# EAGLE schematic udisk (EAGLE 4.16)

## Sheet 1 of 7
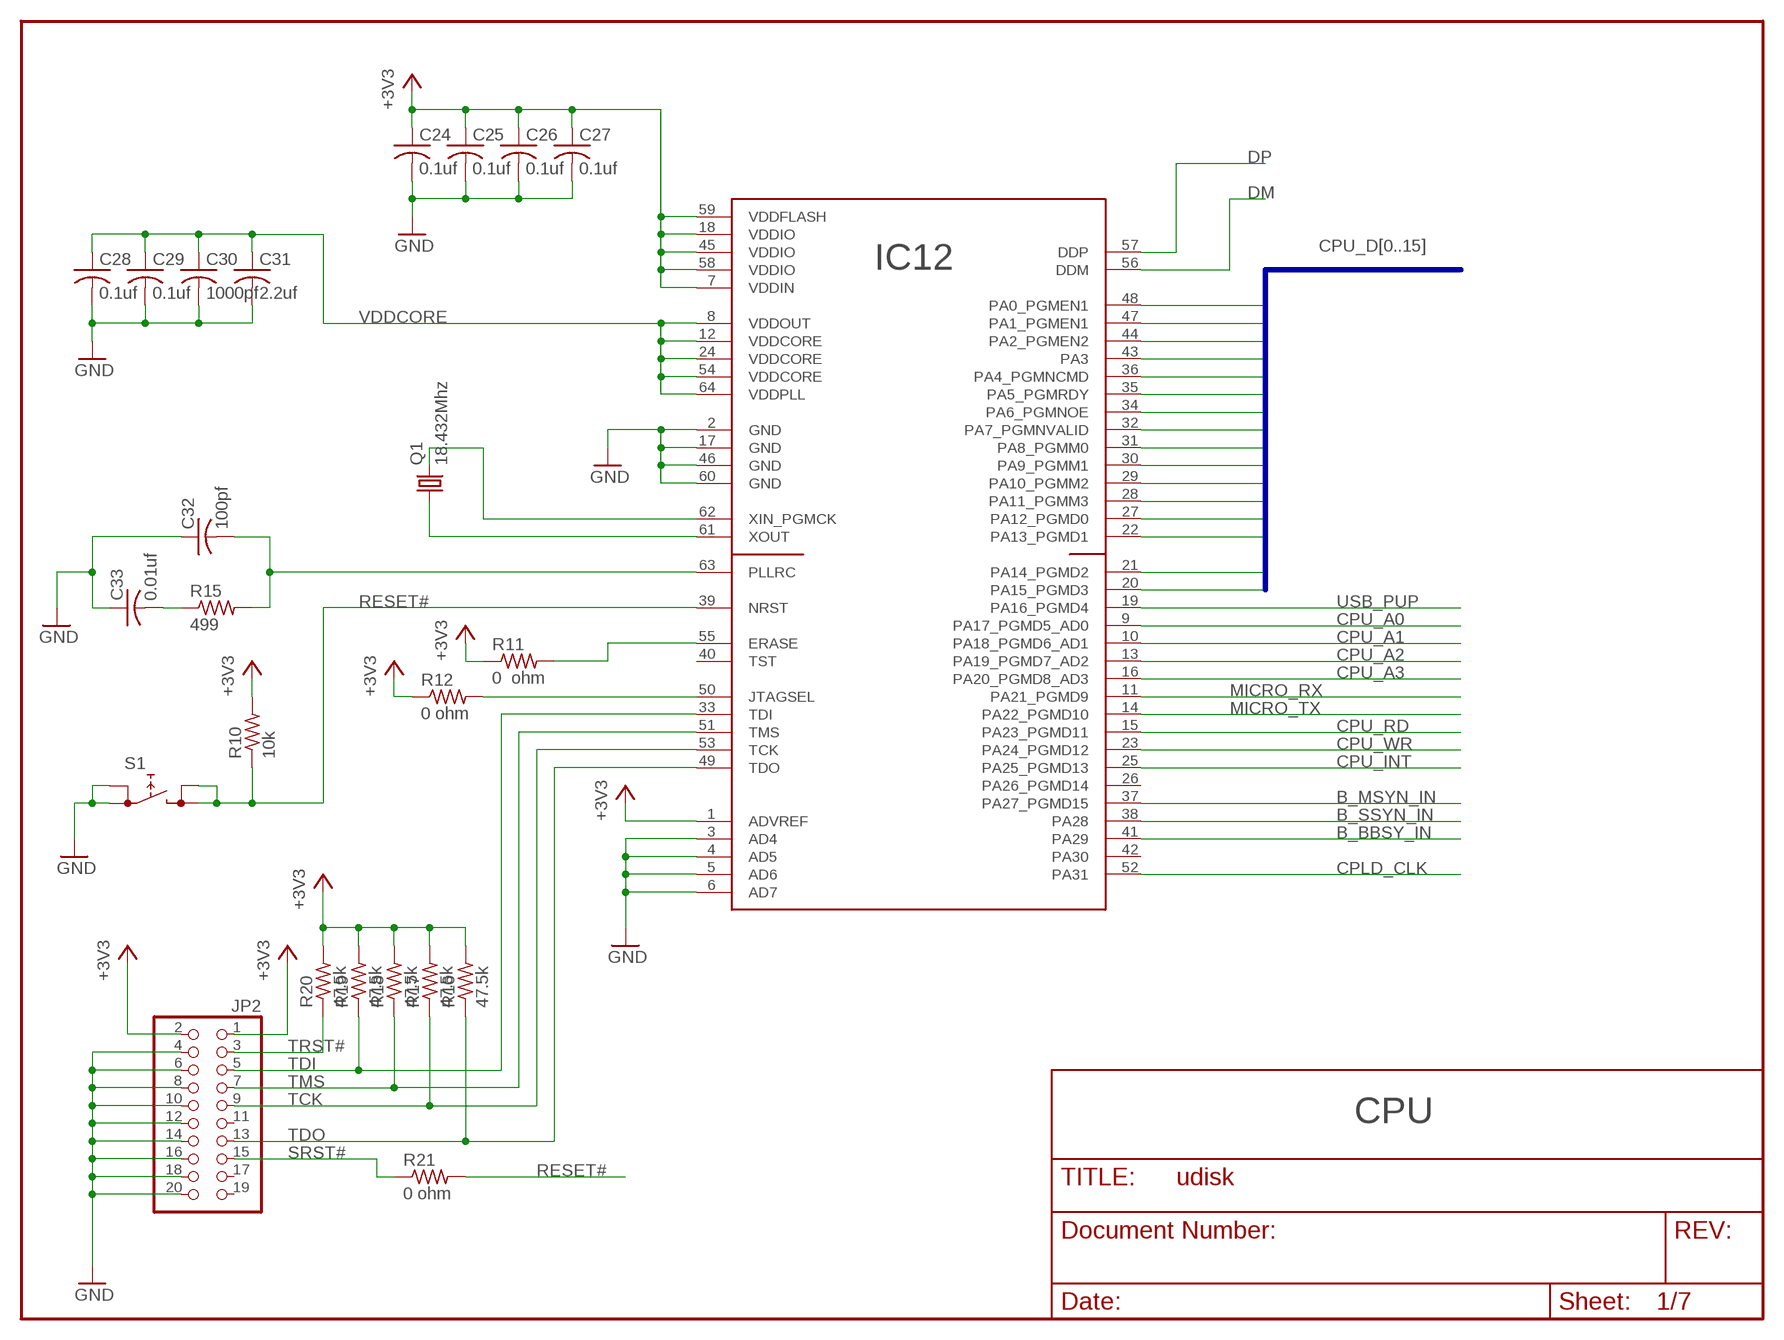
[diagram p0: schematic, sheet 1]

### Parts
C24  0.1uf  C-USC0603  [C0603]
C25  0.1uf  C-USC0603  [C0603]
C26  0.1uf  C-USC0603  [C0603]
C27  0.1uf  C-USC0603  [C0603]
C28  0.1uf  C-USC0603  [C0603]
C29  0.1uf  C-USC0603  [C0603]
C30  1000pf  C-USC0805  [C0805]
C31  2.2uf  C-USC1206  [C1206]
C32  100pf  C-USC0805  [C0805]
C33  0.01uf  C-USC0805  [C0805]
IC12  AT91SAM7S64_LQFP64  [LQFP64]
JP2  PINHD-2X10  [2X10]
Q1  18.432Mhz  CTS406  [SM406]
R10  10k  R-US_R0805  [R0805]
R11  0 ohm  R-US_R0805  [R0805]
R12  0 ohm  R-US_R0805  [R0805]
R15  499  R-US_M0805  [M0805]
R16  47.5k  R-US_R0805  [R0805]
R17  47.5k  R-US_R0805  [R0805]
R18  47.5k  R-US_R0805  [R0805]
R19  47.5k  R-US_R0805  [R0805]
R20  47.5k  R-US_R0805  [R0805]
R21  0 ohm  R-US_R0805  [R0805]
S1  KSC241J  [KSC241J]

### Nets
+3V3: C24.1 C25.1 C26.1 C27.1 IC12.1(ADVREF) IC12.7(VDDIN) IC12.18(VDDIO) IC12.45(VDDIO) IC12.58(VDDIO) IC12.59(VDDFLASH) JP2.1 JP2.2 R10.2 R11.1 R12.1 R16.2 R17.2 R18.2 R19.2 R20.2 ; also sheet 2,5,6,7
B_BBSY_IN: IC12.41(PA29) ; also sheet 2,3
B_MSYN_IN: IC12.37(PA27_PGMD15) ; also sheet 2,3
B_SSYN_IN: IC12.38(PA28) ; also sheet 2,3
CPLD_CLK: IC12.52(PA31) ; also sheet 2
CPU_A0: IC12.9(PA17_PGMD5_AD0) ; also sheet 2,6
CPU_A1: IC12.10(PA18_PGMD6_AD1) ; also sheet 2,6
CPU_A2: IC12.13(PA19_PGMD7_AD2) ; also sheet 2,6
CPU_A3: IC12.16(PA20_PGMD8_AD3) ; also sheet 2
CPU_D0: IC12.48(PA0_PGMEN1) ; also sheet 2,6
CPU_D1: IC12.47(PA1_PGMEN1) ; also sheet 2,6
CPU_D2: IC12.44(PA2_PGMEN2) ; also sheet 2,6
CPU_D3: IC12.43(PA3) ; also sheet 2,6
CPU_D4: IC12.36(PA4_PGMNCMD) ; also sheet 2,6
CPU_D5: IC12.35(PA5_PGMRDY) ; also sheet 2,6
CPU_D6: IC12.34(PA6_PGMNOE) ; also sheet 2,6
CPU_D7: IC12.32(PA7_PGMNVALID) ; also sheet 2,6
CPU_D8: IC12.31(PA8_PGMM0) ; also sheet 2,6
CPU_D9: IC12.30(PA9_PGMM1) ; also sheet 2,6
CPU_D10: IC12.29(PA10_PGMM2) ; also sheet 2,6
CPU_D11: IC12.28(PA11_PGMM3) ; also sheet 2,6
CPU_D12: IC12.27(PA12_PGMD0) ; also sheet 2,6
CPU_D13: IC12.22(PA13_PGMD1) ; also sheet 2,6
CPU_D14: IC12.21(PA14_PGMD2) ; also sheet 2,6
CPU_D15: IC12.20(PA15_PGMD3) ; also sheet 2,6
CPU_INT: IC12.25(PA25_PGMD13) ; also sheet 2
CPU_RD: IC12.15(PA23_PGMD11) ; also sheet 2
CPU_WR: IC12.23(PA24_PGMD12) ; also sheet 2
DM: IC12.56(DDM) ; also sheet 7
DP: IC12.57(DDP) ; also sheet 7
GND: C24.2 C25.2 C26.2 C27.2 C28.2 C29.2 C30.2 C31.2 C32.1 C33.1 IC12.2(GND) IC12.3(AD4) IC12.4(AD5) IC12.5(AD6) IC12.6(AD7) IC12.17(GND) IC12.46(GND) IC12.60(GND) JP2.4 JP2.6 JP2.8 JP2.10 JP2.12 JP2.14 JP2.16 JP2.18 JP2.20 S1.P1 S1.P2 ; also sheet 2,3,4,5,6,7
MICRO_RX: IC12.11(PA21_PGMD9) ; also sheet 5
MICRO_TX: IC12.14(PA22_PGMD10) ; also sheet 5
N$21: IC12.55(ERASE) R11.2
N$22: IC12.50(JTAGSEL) R12.2
N$24: IC12.62(XIN_PGMCK) Q1.3
N$29: IC12.61(XOUT) Q1.1
N$30: C32.2 IC12.63(PLLRC) R15.2
N$32: C33.2 R15.1
RESET#: IC12.39(NRST) R10.1 R21.2 S1.P3 S1.P4
SRST#: JP2.15 R21.1
TCK: IC12.53(TCK) JP2.9 R17.1
TDI: IC12.33(TDI) JP2.5 R19.1
TDO: IC12.49(TDO) JP2.13 R16.1
TMS: IC12.51(TMS) JP2.7 R18.1
TRST#: JP2.3 R20.1
USB_PUP: IC12.19(PA16_PGMD4) ; also sheet 7
VDDCORE: C28.1 C29.1 C30.1 C31.1 IC12.8(VDDOUT) IC12.12(VDDCORE) IC12.24(VDDCORE) IC12.54(VDDCORE) IC12.64(VDDPLL)
Unconnected: IC12.26(PA26_PGMD14) IC12.40(TST) IC12.42(PA30) JP2.11 JP2.17 JP2.19

### Buses
CPU_D[0..15]

### Notes on the sheet
- CPU

## Sheet 2 of 7
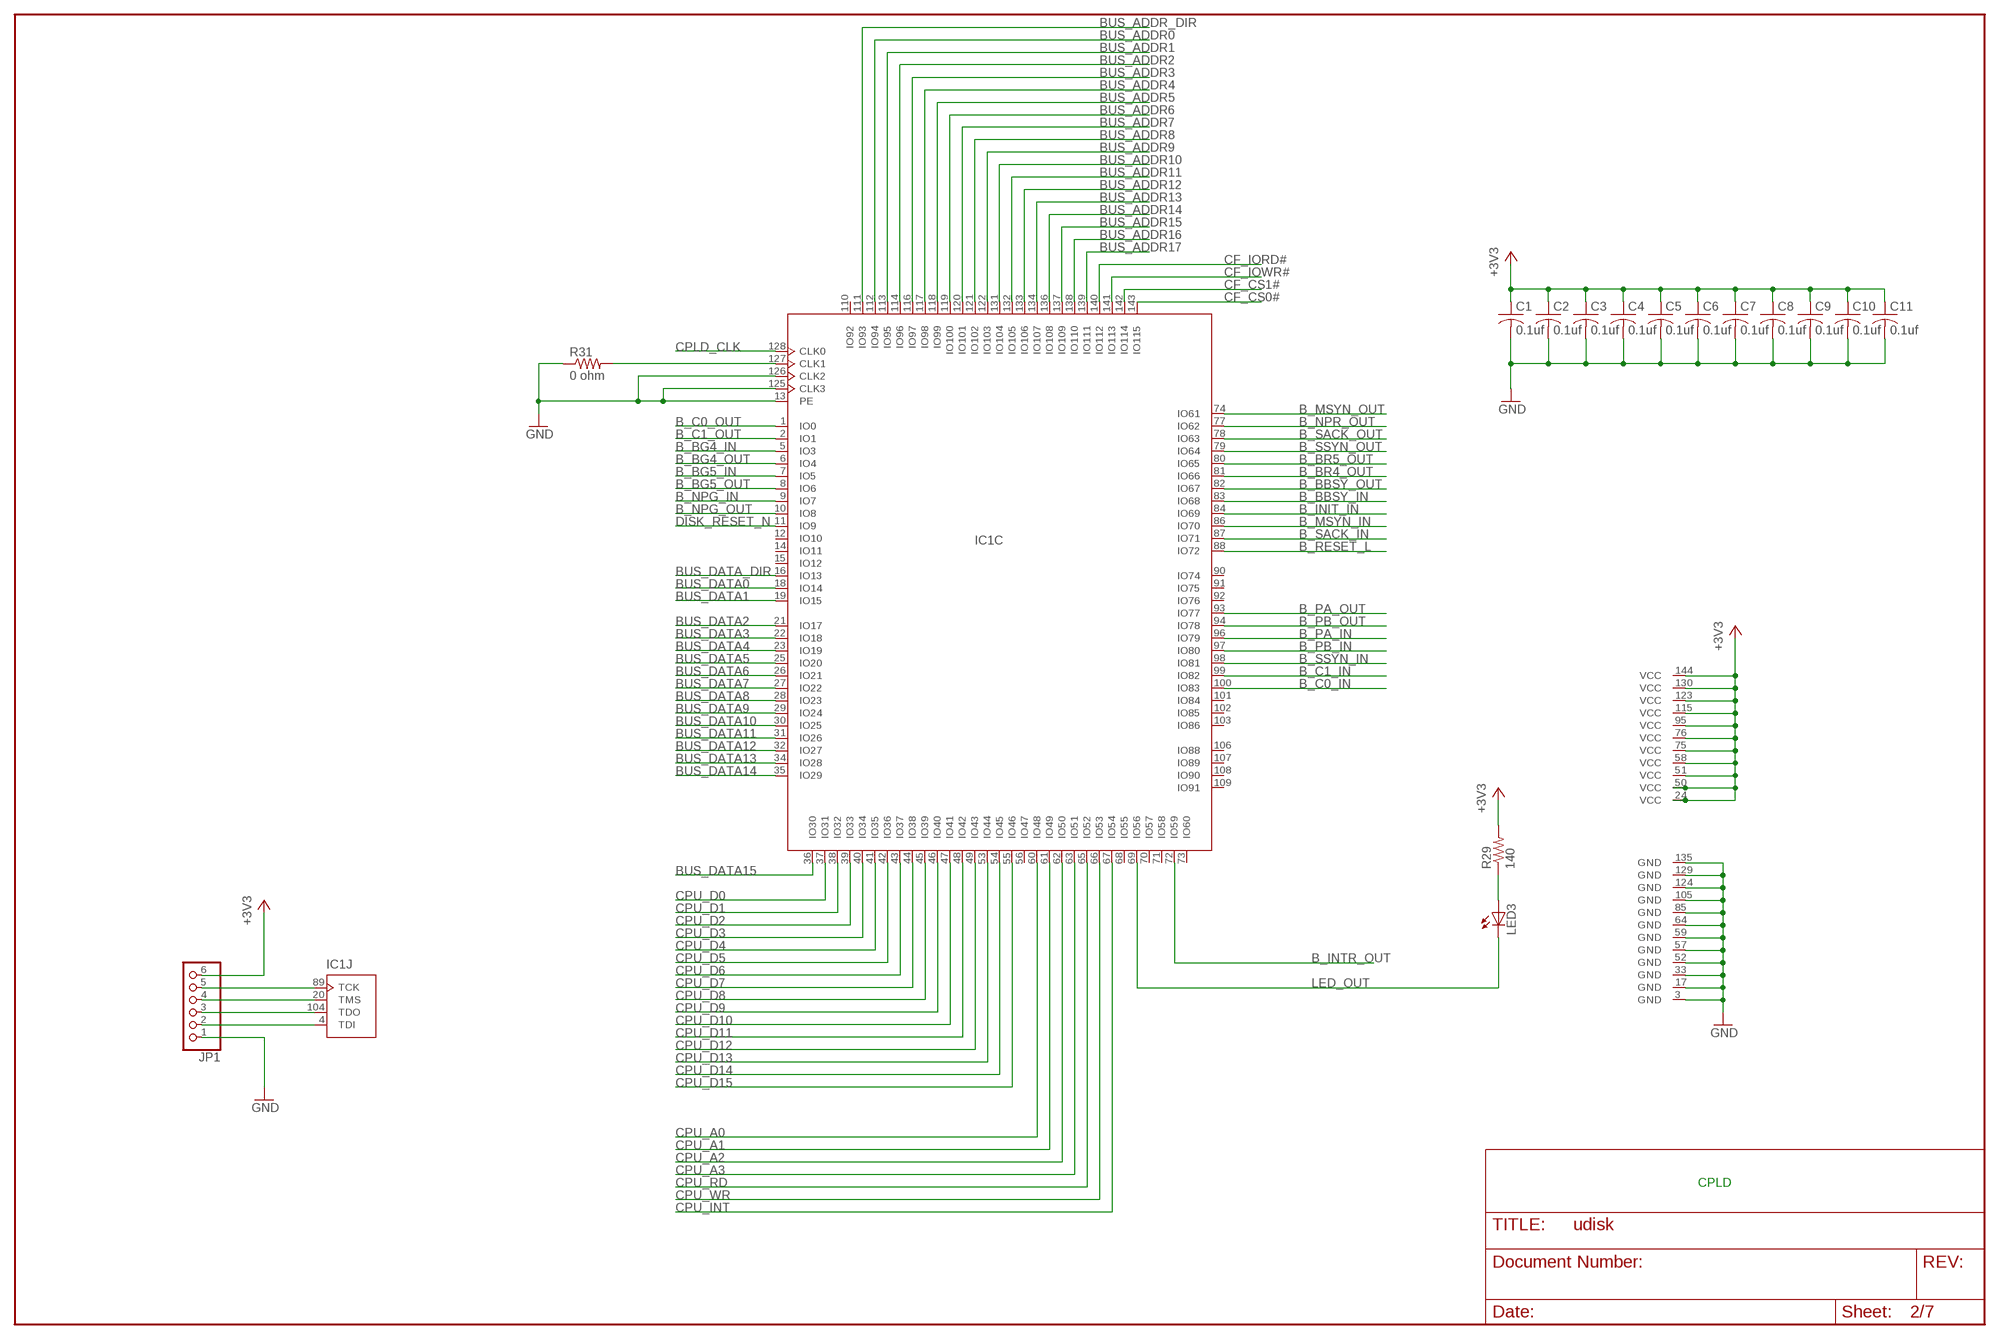
[diagram p1: schematic, sheet 2]

### Parts
C1  0.1uf  C-USC0603  [C0603]
C2  0.1uf  C-USC0603  [C0603]
C3  0.1uf  C-USC0603  [C0603]
C4  0.1uf  C-USC0603  [C0603]
C5  0.1uf  C-USC0603  [C0603]
C6  0.1uf  C-USC0603  [C0603]
C7  0.1uf  C-USC0603  [C0603]
C8  0.1uf  C-USC0603  [C0603]
C9  0.1uf  C-USC0603  [C0603]
C10  0.1uf  C-USC0603  [C0603]
C11  0.1uf  C-USC0603  [C0603]
IC1  XCR3256XLTQ144  [TQ144]
JP1  PINHD-1X6  [1X06]
LED3  LEDB156  [Q62902-B156]
R29  140  R-US_R0805  [R0805]
R31  0 ohm  R-US_R0805  [R0805]

### Nets
+3V3: C1.1 C2.1 C3.1 C4.1 C5.1 C6.1 C7.1 C8.1 C9.1 C10.1 C11.1 IC1.24(V1:VCC) IC1.50(V2:VCC) IC1.51(V3:VCC) IC1.58(V4:VCC) IC1.75(V5:VCC) IC1.76(V6:VCC) IC1.95(V7:VCC) IC1.115(V8:VCC) IC1.123(V9:VCC) IC1.130(V10:VCC) IC1.144(V11:VCC) JP1.6 R29.2 ; also sheet 1,5,6,7
B_BBSY_IN: IC1.83(C:IO68) ; also sheet 1,3
B_BBSY_OUT: IC1.82(C:IO67) ; also sheet 3
B_BG4_IN: IC1.5(C:IO3) ; also sheet 3
B_BG4_OUT: IC1.6(C:IO4) ; also sheet 3
B_BG5_IN: IC1.7(C:IO5) ; also sheet 3
B_BG5_OUT: IC1.8(C:IO6) ; also sheet 3
B_BR4_OUT: IC1.81(C:IO66) ; also sheet 3
B_BR5_OUT: IC1.80(C:IO65) ; also sheet 3
B_C0_IN: IC1.100(C:IO83) ; also sheet 3
B_C0_OUT: IC1.1(C:IO0) ; also sheet 3
B_C1_IN: IC1.99(C:IO82) ; also sheet 3
B_C1_OUT: IC1.2(C:IO1) ; also sheet 3
B_INIT_IN: IC1.84(C:IO69) ; also sheet 3
B_INTR_OUT: IC1.72(C:IO59) ; also sheet 3
B_MSYN_IN: IC1.86(C:IO70) ; also sheet 1,3
B_MSYN_OUT: IC1.74(C:IO61) ; also sheet 3
B_NPG_IN: IC1.9(C:IO7) ; also sheet 3
B_NPG_OUT: IC1.10(C:IO8) ; also sheet 3
B_NPR_OUT: IC1.77(C:IO62) ; also sheet 3
B_PA_IN: IC1.96(C:IO79) ; also sheet 3
B_PA_OUT: IC1.93(C:IO77) ; also sheet 3
B_PB_IN: IC1.97(C:IO80) ; also sheet 3
B_PB_OUT: IC1.94(C:IO78) ; also sheet 3
B_RESET_L: IC1.88(C:IO72)
B_SACK_IN: IC1.87(C:IO71) ; also sheet 3
B_SACK_OUT: IC1.78(C:IO63) ; also sheet 3
B_SSYN_IN: IC1.98(C:IO81) ; also sheet 1,3
B_SSYN_OUT: IC1.79(C:IO64) ; also sheet 3
BUS_ADDR0: IC1.112(C:IO94) ; also sheet 3
BUS_ADDR1: IC1.113(C:IO95) ; also sheet 3
BUS_ADDR2: IC1.114(C:IO96) ; also sheet 3
BUS_ADDR3: IC1.116(C:IO97) ; also sheet 3
BUS_ADDR4: IC1.117(C:IO98) ; also sheet 3
BUS_ADDR5: IC1.118(C:IO99) ; also sheet 3
BUS_ADDR6: IC1.119(C:IO100) ; also sheet 3
BUS_ADDR7: IC1.120(C:IO101) ; also sheet 3
BUS_ADDR8: IC1.121(C:IO102) ; also sheet 3
BUS_ADDR9: IC1.122(C:IO103) ; also sheet 3
BUS_ADDR10: IC1.131(C:IO104) ; also sheet 3
BUS_ADDR11: IC1.132(C:IO105) ; also sheet 3
BUS_ADDR12: IC1.133(C:IO106) ; also sheet 3
BUS_ADDR13: IC1.134(C:IO107) ; also sheet 3
BUS_ADDR14: IC1.136(C:IO108) ; also sheet 3
BUS_ADDR15: IC1.137(C:IO109) ; also sheet 3
BUS_ADDR16: IC1.138(C:IO110) ; also sheet 3
BUS_ADDR17: IC1.139(C:IO111) ; also sheet 3
BUS_ADDR_DIR: IC1.111(C:IO93) ; also sheet 3
BUS_DATA0: IC1.18(C:IO14) ; also sheet 3
BUS_DATA1: IC1.19(C:IO15) ; also sheet 3
BUS_DATA2: IC1.21(C:IO17) ; also sheet 3
BUS_DATA3: IC1.22(C:IO18) ; also sheet 3
BUS_DATA4: IC1.23(C:IO19) ; also sheet 3
BUS_DATA5: IC1.25(C:IO20) ; also sheet 3
BUS_DATA6: IC1.26(C:IO21) ; also sheet 3
BUS_DATA7: IC1.27(C:IO22) ; also sheet 3
BUS_DATA8: IC1.28(C:IO23) ; also sheet 3
BUS_DATA9: IC1.29(C:IO24) ; also sheet 3
BUS_DATA10: IC1.30(C:IO25) ; also sheet 3
BUS_DATA11: IC1.31(C:IO26) ; also sheet 3
BUS_DATA12: IC1.32(C:IO27) ; also sheet 3
BUS_DATA13: IC1.34(C:IO28) ; also sheet 3
BUS_DATA14: IC1.35(C:IO29) ; also sheet 3
BUS_DATA15: IC1.36(C:IO30) ; also sheet 3
BUS_DATA_DIR: IC1.16(C:IO13) ; also sheet 3
CF_CS0#: IC1.143(C:IO115) ; also sheet 6
CF_CS1#: IC1.142(C:IO114) ; also sheet 6
CF_IORD#: IC1.140(C:IO112) ; also sheet 6
CF_IOWR#: IC1.141(C:IO113) ; also sheet 6
CPLD_CLK: IC1.128(C:CLK0) ; also sheet 1
CPU_A0: IC1.60(C:IO48) ; also sheet 1,6
CPU_A1: IC1.61(C:IO49) ; also sheet 1,6
CPU_A2: IC1.62(C:IO50) ; also sheet 1,6
CPU_A3: IC1.63(C:IO51) ; also sheet 1
CPU_D0: IC1.37(C:IO31) ; also sheet 1,6
CPU_D1: IC1.38(C:IO32) ; also sheet 1,6
CPU_D2: IC1.39(C:IO33) ; also sheet 1,6
CPU_D3: IC1.40(C:IO34) ; also sheet 1,6
CPU_D4: IC1.41(C:IO35) ; also sheet 1,6
CPU_D5: IC1.42(C:IO36) ; also sheet 1,6
CPU_D6: IC1.43(C:IO37) ; also sheet 1,6
CPU_D7: IC1.44(C:IO38) ; also sheet 1,6
CPU_D8: IC1.45(C:IO39) ; also sheet 1,6
CPU_D9: IC1.46(C:IO40) ; also sheet 1,6
CPU_D10: IC1.47(C:IO41) ; also sheet 1,6
CPU_D11: IC1.48(C:IO42) ; also sheet 1,6
CPU_D12: IC1.49(C:IO43) ; also sheet 1,6
CPU_D13: IC1.53(C:IO44) ; also sheet 1,6
CPU_D14: IC1.54(C:IO45) ; also sheet 1,6
CPU_D15: IC1.55(C:IO46) ; also sheet 1,6
CPU_INT: IC1.67(C:IO54) ; also sheet 1
CPU_RD: IC1.65(C:IO52) ; also sheet 1
CPU_WR: IC1.66(C:IO53) ; also sheet 1
DISK_RESET_N: IC1.11(C:IO9) ; also sheet 6
GND: C1.2 C2.2 C3.2 C4.2 C5.2 C6.2 C7.2 C8.2 C9.2 C10.2 C11.2 IC1.3(GND) IC1.13(C:PE) IC1.17(GND) IC1.33(GND) IC1.52(GND) IC1.57(GND) IC1.59(GND) IC1.64(GND) IC1.85(GND) IC1.105(GND) IC1.124(GND) IC1.125(C:CLK3) IC1.126(C:CLK2) IC1.129(GND) IC1.135(GND) JP1.1 R31.1 ; also sheet 1,3,4,5,6,7
LED_OUT: IC1.69(C:IO56) LED3.K(C)
N$3: LED3.A R29.1
N$5: IC1.127(C:CLK1) R31.2
N$13: IC1.89(J:TCK) JP1.5
N$14: IC1.20(J:TMS) JP1.4
N$15: IC1.104(J:TDO) JP1.3
N$16: IC1.4(J:TDI) JP1.2
Unconnected: IC1.12(C:IO10) IC1.14(C:IO11) IC1.15(C:IO12) IC1.56(C:IO47) IC1.68(C:IO55) IC1.70(C:IO57) IC1.71(C:IO58) IC1.73(C:IO60) IC1.90(C:IO74) IC1.91(C:IO75) IC1.92(C:IO76) IC1.101(C:IO84) IC1.102(C:IO85) IC1.103(C:IO86) IC1.106(C:IO88) IC1.107(C:IO89) IC1.108(C:IO90) IC1.109(C:IO91) IC1.110(C:IO92)

### Notes on the sheet
- CPLD

## Sheet 3 of 7
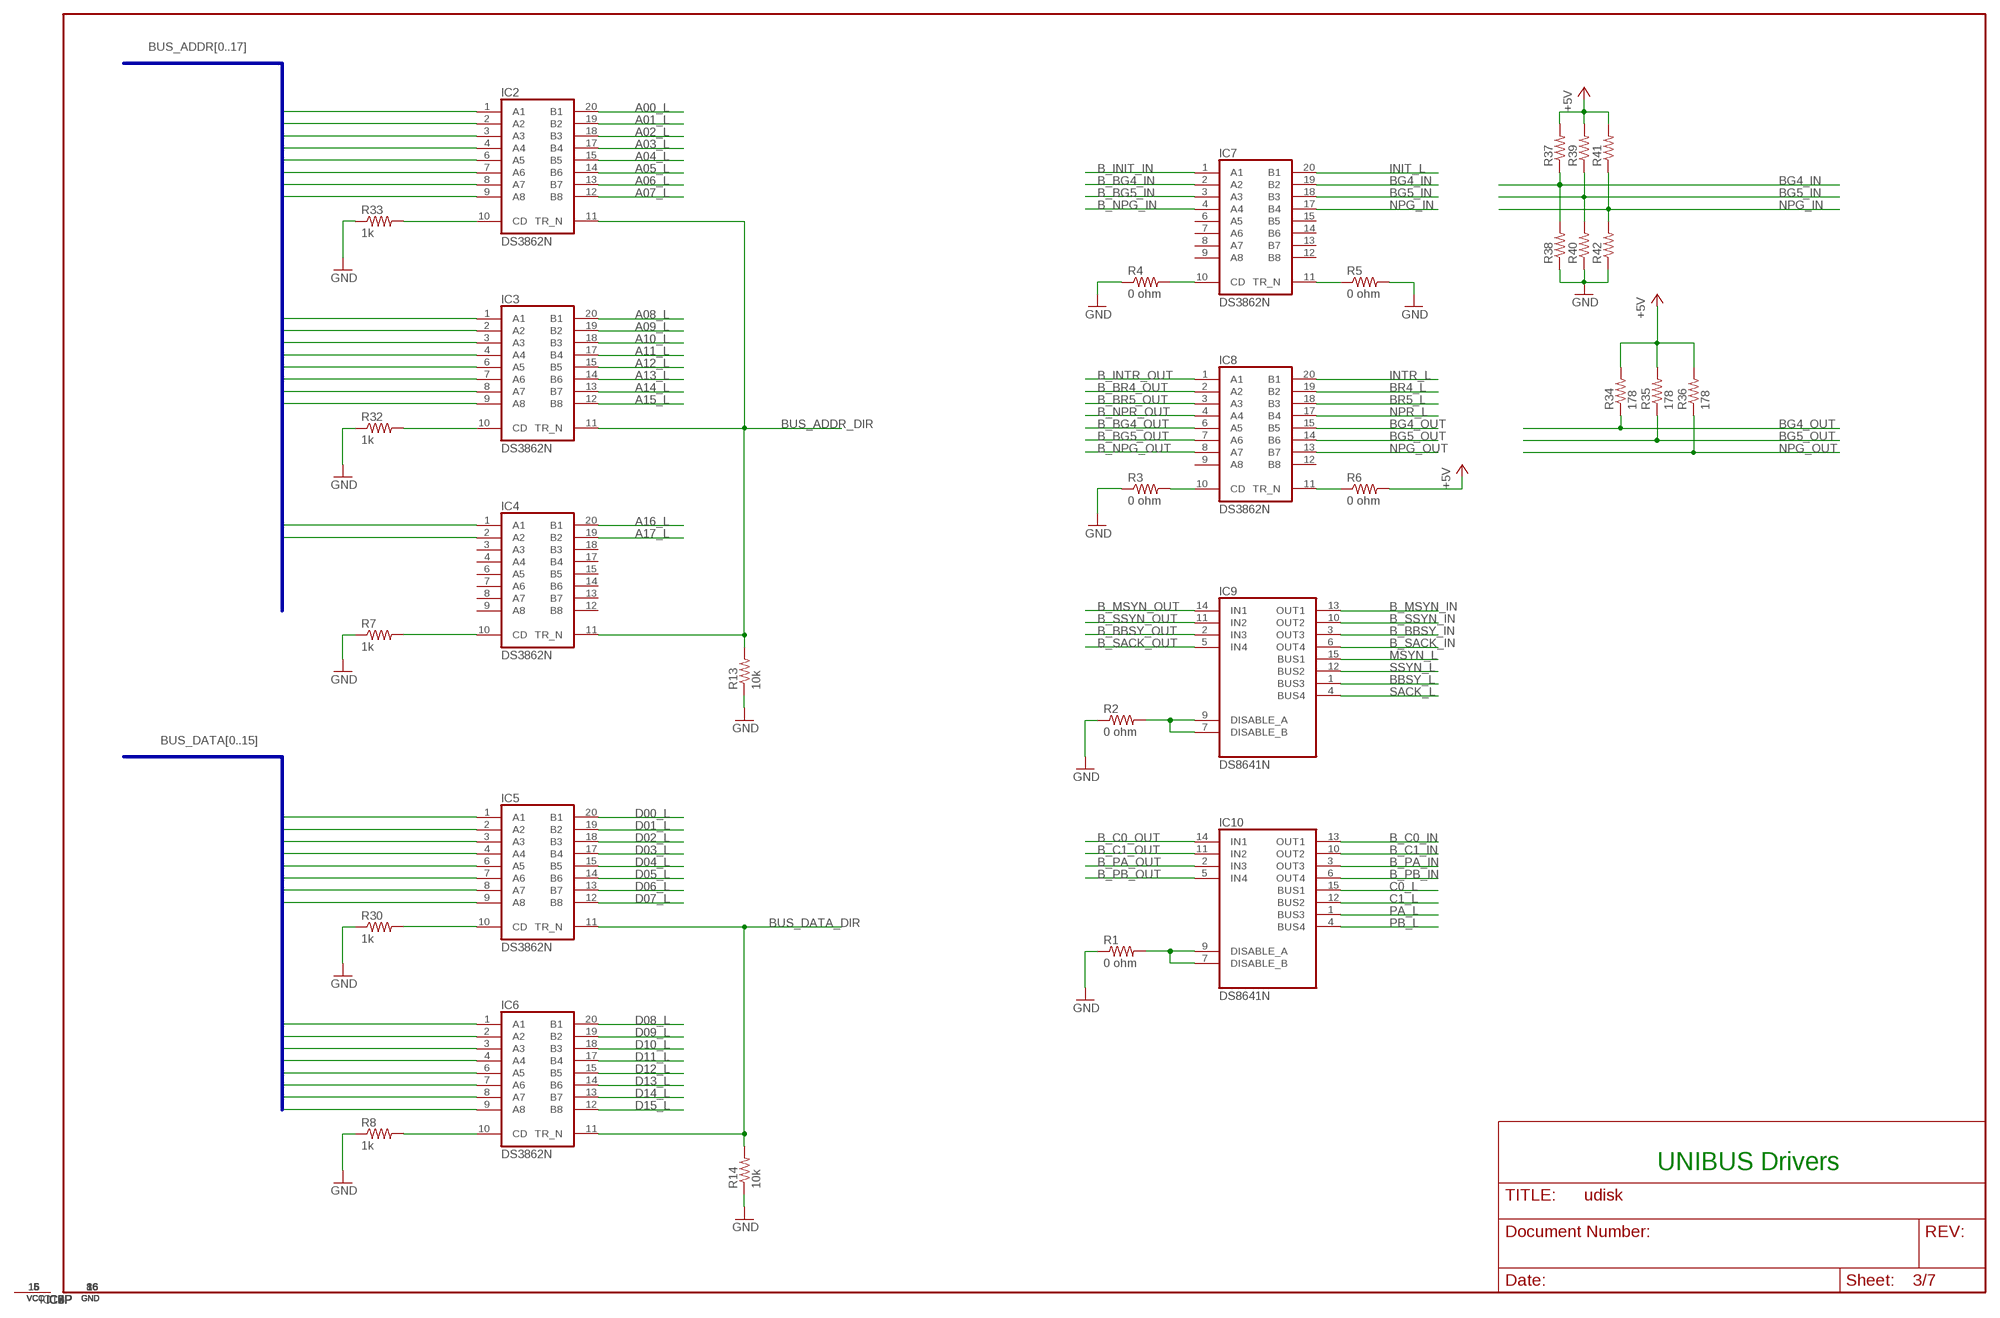
[diagram p2: schematic, sheet 3]

### Parts
IC2  DS3862N  [DIL20]
IC3  DS3862N  [DIL20]
IC4  DS3862N  [DIL20]
IC5  DS3862N  [DIL20]
IC6  DS3862N  [DIL20]
IC7  DS3862N  [DIL20]
IC8  DS3862N  [DIL20]
IC9  DS8641N  [DIL16]
IC10  DS8641N  [DIL16]
R1  0 ohm  R-US_R0805  [R0805]
R2  0 ohm  R-US_R0805  [R0805]
R3  0 ohm  R-US_R0805  [R0805]
R4  0 ohm  R-US_R0805  [R0805]
R5  0 ohm  R-US_R0805  [R0805]
R6  0 ohm  R-US_R0805  [R0805]
R7  1k  R-US_R0805  [R0805]
R8  1k  R-US_R0805  [R0805]
R13  10k  R-US_R0805  [R0805]
R14  10k  R-US_R0805  [R0805]
R30  1k  R-US_R0805  [R0805]
R32  1k  R-US_R0805  [R0805]
R33  1k  R-US_R0805  [R0805]
R34  178  R-US_R0805  [R0805]
R35  178  R-US_R0805  [R0805]
R36  178  R-US_R0805  [R0805]
R37  R-US_R0805  [R0805]
R38  R-US_R0805  [R0805]
R39  R-US_R0805  [R0805]
R40  R-US_R0805  [R0805]
R41  R-US_R0805  [R0805]
R42  R-US_R0805  [R0805]

### Nets
+5V: R6.2 R34.2 R35.2 R36.2 R37.2 R39.2 R41.2 ; also sheet 4,5,6
A00_L: IC2.20(B1) ; also sheet 4
A01_L: IC2.19(B2) ; also sheet 4
A02_L: IC2.18(B3) ; also sheet 4
A03_L: IC2.17(B4) ; also sheet 4
A04_L: IC2.15(B5) ; also sheet 4
A05_L: IC2.14(B6) ; also sheet 4
A06_L: IC2.13(B7) ; also sheet 4
A07_L: IC2.12(B8) ; also sheet 4
A08_L: IC3.20(B1) ; also sheet 4
A09_L: IC3.19(B2) ; also sheet 4
A10_L: IC3.18(B3) ; also sheet 4
A11_L: IC3.17(B4) ; also sheet 4
A12_L: IC3.15(B5) ; also sheet 4
A13_L: IC3.14(B6) ; also sheet 4
A14_L: IC3.13(B7) ; also sheet 4
A15_L: IC3.12(B8) ; also sheet 4
A16_L: IC4.20(B1) ; also sheet 4
A17_L: IC4.19(B2) ; also sheet 4
B_BBSY_IN: IC9.3(OUT3) ; also sheet 1,2
B_BBSY_OUT: IC9.2(IN3) ; also sheet 2
B_BG4_IN: IC7.2(A2) ; also sheet 2
B_BG4_OUT: IC8.6(A5) ; also sheet 2
B_BG5_IN: IC7.3(A3) ; also sheet 2
B_BG5_OUT: IC8.7(A6) ; also sheet 2
B_BR4_OUT: IC8.2(A2) ; also sheet 2
B_BR5_OUT: IC8.3(A3) ; also sheet 2
B_C0_IN: IC10.13(OUT1) ; also sheet 2
B_C0_OUT: IC10.14(IN1) ; also sheet 2
B_C1_IN: IC10.10(OUT2) ; also sheet 2
B_C1_OUT: IC10.11(IN2) ; also sheet 2
B_INIT_IN: IC7.1(A1) ; also sheet 2
B_INTR_OUT: IC8.1(A1) ; also sheet 2
B_MSYN_IN: IC9.13(OUT1) ; also sheet 1,2
B_MSYN_OUT: IC9.14(IN1) ; also sheet 2
B_NPG_IN: IC7.4(A4) ; also sheet 2
B_NPG_OUT: IC8.8(A7) ; also sheet 2
B_NPR_OUT: IC8.4(A4) ; also sheet 2
B_PA_IN: IC10.3(OUT3) ; also sheet 2
B_PA_OUT: IC10.2(IN3) ; also sheet 2
B_PB_IN: IC10.6(OUT4) ; also sheet 2
B_PB_OUT: IC10.5(IN4) ; also sheet 2
B_SACK_IN: IC9.6(OUT4) ; also sheet 2
B_SACK_OUT: IC9.5(IN4) ; also sheet 2
B_SSYN_IN: IC9.10(OUT2) ; also sheet 1,2
B_SSYN_OUT: IC9.11(IN2) ; also sheet 2
BBSY_L: IC9.1(BUS3) ; also sheet 4
BG4_IN: IC7.19(B2) R37.1 R38.2 ; also sheet 4
BG4_OUT: IC8.15(B5) R34.1 ; also sheet 4
BG5_IN: IC7.18(B3) R39.1 R40.2 ; also sheet 4
BG5_OUT: IC8.14(B6) R35.1 ; also sheet 4
BR4_L: IC8.19(B2) ; also sheet 4
BR5_L: IC8.18(B3) ; also sheet 4
BUS_ADDR0: IC2.1(A1) ; also sheet 2
BUS_ADDR1: IC2.2(A2) ; also sheet 2
BUS_ADDR2: IC2.3(A3) ; also sheet 2
BUS_ADDR3: IC2.4(A4) ; also sheet 2
BUS_ADDR4: IC2.6(A5) ; also sheet 2
BUS_ADDR5: IC2.7(A6) ; also sheet 2
BUS_ADDR6: IC2.8(A7) ; also sheet 2
BUS_ADDR7: IC2.9(A8) ; also sheet 2
BUS_ADDR8: IC3.1(A1) ; also sheet 2
BUS_ADDR9: IC3.2(A2) ; also sheet 2
BUS_ADDR10: IC3.3(A3) ; also sheet 2
BUS_ADDR11: IC3.4(A4) ; also sheet 2
BUS_ADDR12: IC3.6(A5) ; also sheet 2
BUS_ADDR13: IC3.7(A6) ; also sheet 2
BUS_ADDR14: IC3.8(A7) ; also sheet 2
BUS_ADDR15: IC3.9(A8) ; also sheet 2
BUS_ADDR16: IC4.1(A1) ; also sheet 2
BUS_ADDR17: IC4.2(A2) ; also sheet 2
BUS_ADDR_DIR: IC2.11(TR_N) IC3.11(TR_N) IC4.11(TR_N) R13.2 ; also sheet 2
BUS_DATA0: IC5.1(A1) ; also sheet 2
BUS_DATA1: IC5.2(A2) ; also sheet 2
BUS_DATA2: IC5.3(A3) ; also sheet 2
BUS_DATA3: IC5.4(A4) ; also sheet 2
BUS_DATA4: IC5.6(A5) ; also sheet 2
BUS_DATA5: IC5.7(A6) ; also sheet 2
BUS_DATA6: IC5.8(A7) ; also sheet 2
BUS_DATA7: IC5.9(A8) ; also sheet 2
BUS_DATA8: IC6.1(A1) ; also sheet 2
BUS_DATA9: IC6.2(A2) ; also sheet 2
BUS_DATA10: IC6.3(A3) ; also sheet 2
BUS_DATA11: IC6.4(A4) ; also sheet 2
BUS_DATA12: IC6.6(A5) ; also sheet 2
BUS_DATA13: IC6.7(A6) ; also sheet 2
BUS_DATA14: IC6.8(A7) ; also sheet 2
BUS_DATA15: IC6.9(A8) ; also sheet 2
BUS_DATA_DIR: IC5.11(TR_N) IC6.11(TR_N) R14.2 ; also sheet 2
C0_L: IC10.15(BUS1) ; also sheet 4
C1_L: IC10.12(BUS2) ; also sheet 4
D00_L: IC5.20(B1) ; also sheet 4
D01_L: IC5.19(B2) ; also sheet 4
D02_L: IC5.18(B3) ; also sheet 4
D03_L: IC5.17(B4) ; also sheet 4
D04_L: IC5.15(B5) ; also sheet 4
D05_L: IC5.14(B6) ; also sheet 4
D06_L: IC5.13(B7) ; also sheet 4
D07_L: IC5.12(B8) ; also sheet 4
D08_L: IC6.20(B1) ; also sheet 4
D09_L: IC6.19(B2) ; also sheet 4
D10_L: IC6.18(B3) ; also sheet 4
D11_L: IC6.17(B4) ; also sheet 4
D12_L: IC6.15(B5) ; also sheet 4
D13_L: IC6.14(B6) ; also sheet 4
D14_L: IC6.13(B7) ; also sheet 4
D15_L: IC6.12(B8) ; also sheet 4
GND: R1.1 R2.1 R3.1 R4.1 R5.2 R7.1 R8.1 R13.1 R14.1 R30.1 R32.1 R33.1 R38.1 R40.1 R42.1 ; also sheet 1,2,4,5,6,7
INIT_L: IC7.20(B1) ; also sheet 4
INTR_L: IC8.20(B1) ; also sheet 4
MSYN_L: IC9.15(BUS1) ; also sheet 4
N$1: IC9.7(DISABLE_B) IC9.9(DISABLE_A) R2.2
N$2: IC10.7(DISABLE_B) IC10.9(DISABLE_A) R1.2
N$7: IC7.10(CD) R4.2
N$8: IC8.10(CD) R3.2
N$9: IC7.11(TR_N) R5.1
N$10: IC8.11(TR_N) R6.1
N$11: IC4.10(CD) R7.2
N$12: IC6.10(CD) R8.2
N$18: IC5.10(CD) R30.2
N$20: IC2.10(CD) R33.2
N$25: IC3.10(CD) R32.2
NPG_IN: IC7.17(B4) R41.1 R42.2 ; also sheet 4
NPG_OUT: IC8.13(B7) R36.1 ; also sheet 4
NPR_L: IC8.17(B4) ; also sheet 4
PA_L: IC10.1(BUS3) ; also sheet 4
PB_L: IC10.4(BUS4) ; also sheet 4
SACK_L: IC9.4(BUS4) ; also sheet 4
SSYN_L: IC9.12(BUS2) ; also sheet 4

### Buses
BUS_ADDR[0..17]
BUS_DATA[0..15]

### Notes on the sheet
- UNIBUS Drivers

## Sheet 4 of 7
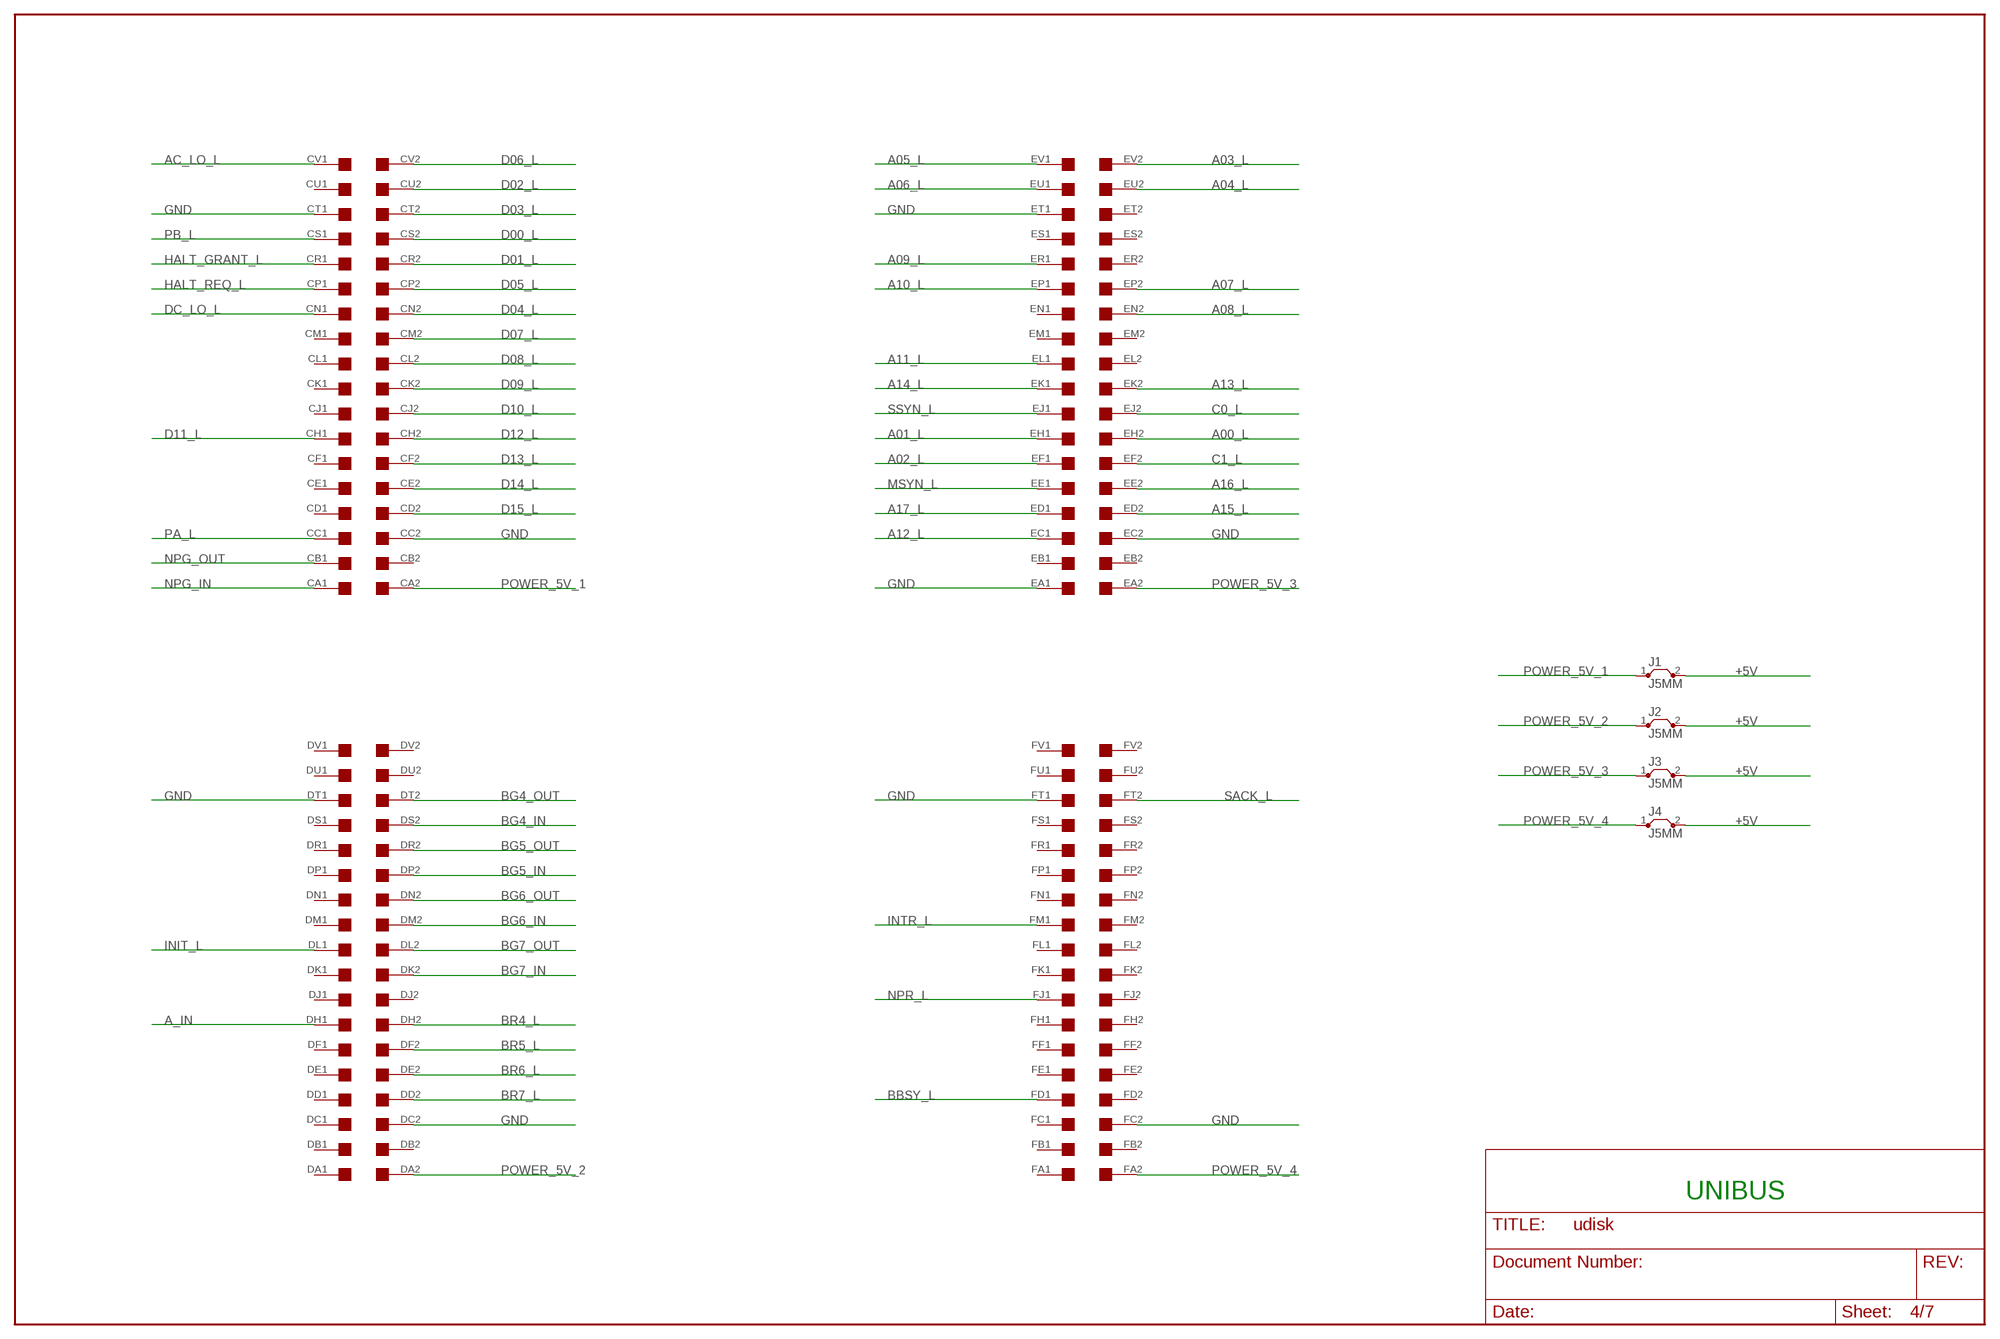
[diagram p3: schematic, sheet 4]

### Parts
J1  J5MM  [05]
J2  J5MM  [05]
J3  J5MM  [05]
J4  J5MM  [05]
U$1  QUAD-CDEF  [EDGE-CON8]

### Nets
+5V: J1.2 J2.2 J3.2 J4.2 ; also sheet 3,5,6
A00_L: U$1.EH2 ; also sheet 3
A01_L: U$1.EH1 ; also sheet 3
A02_L: U$1.EF1 ; also sheet 3
A03_L: U$1.EV2 ; also sheet 3
A04_L: U$1.EU2 ; also sheet 3
A05_L: U$1.EV1 ; also sheet 3
A06_L: U$1.EU1 ; also sheet 3
A07_L: U$1.EP2 ; also sheet 3
A08_L: U$1.EN2 ; also sheet 3
A09_L: U$1.ER1 ; also sheet 3
A10_L: U$1.EP1 ; also sheet 3
A11_L: U$1.EL1 ; also sheet 3
A12_L: U$1.EC1 ; also sheet 3
A13_L: U$1.EK2 ; also sheet 3
A14_L: U$1.EK1 ; also sheet 3
A15_L: U$1.ED2 ; also sheet 3
A16_L: U$1.EE2 ; also sheet 3
A17_L: U$1.ED1 ; also sheet 3
A_IN: U$1.DH1
AC_LO_L: U$1.CV1
BBSY_L: U$1.FD1 ; also sheet 3
BG4_IN: U$1.DS2 ; also sheet 3
BG4_OUT: U$1.DT2 ; also sheet 3
BG5_IN: U$1.DP2 ; also sheet 3
BG5_OUT: U$1.DR2 ; also sheet 3
BG6_IN: U$1.DM2
BG6_OUT: U$1.DN2
BG7_IN: U$1.DK2
BG7_OUT: U$1.DL2
BR4_L: U$1.DH2 ; also sheet 3
BR5_L: U$1.DF2 ; also sheet 3
BR6_L: U$1.DE2
BR7_L: U$1.DD2
C0_L: U$1.EJ2 ; also sheet 3
C1_L: U$1.EF2 ; also sheet 3
D00_L: U$1.CS2 ; also sheet 3
D01_L: U$1.CR2 ; also sheet 3
D02_L: U$1.CU2 ; also sheet 3
D03_L: U$1.CT2 ; also sheet 3
D04_L: U$1.CN2 ; also sheet 3
D05_L: U$1.CP2 ; also sheet 3
D06_L: U$1.CV2 ; also sheet 3
D07_L: U$1.CM2 ; also sheet 3
D08_L: U$1.CL2 ; also sheet 3
D09_L: U$1.CK2 ; also sheet 3
D10_L: U$1.CJ2 ; also sheet 3
D11_L: U$1.CH1 ; also sheet 3
D12_L: U$1.CH2 ; also sheet 3
D13_L: U$1.CF2 ; also sheet 3
D14_L: U$1.CE2 ; also sheet 3
D15_L: U$1.CD2 ; also sheet 3
DC_LO_L: U$1.CN1
GND: U$1.CC2 U$1.CT1 U$1.DC2 U$1.DT1 U$1.EA1 U$1.EC2 U$1.ET1 U$1.FC2 U$1.FT1 ; also sheet 1,2,3,5,6,7
HALT_GRANT_L: U$1.CR1
HALT_REQ_L: U$1.CP1
INIT_L: U$1.DL1 ; also sheet 3
INTR_L: U$1.FM1 ; also sheet 3
MSYN_L: U$1.EE1 ; also sheet 3
NPG_IN: U$1.CA1 ; also sheet 3
NPG_OUT: U$1.CB1 ; also sheet 3
NPR_L: U$1.FJ1 ; also sheet 3
PA_L: U$1.CC1 ; also sheet 3
PB_L: U$1.CS1 ; also sheet 3
POWER_5V_1: J1.1 U$1.CA2
POWER_5V_2: J2.1 U$1.DA2
POWER_5V_3: J3.1 U$1.EA2
POWER_5V_4: J4.1 U$1.FA2
SACK_L: U$1.FT2 ; also sheet 3
SSYN_L: U$1.EJ1 ; also sheet 3
Unconnected: U$1.CB2 U$1.CD1 U$1.CE1 U$1.CF1 U$1.CJ1 U$1.CK1 U$1.CL1 U$1.CM1 U$1.CU1 U$1.DA1 U$1.DB1 U$1.DB2 U$1.DC1 U$1.DD1 U$1.DE1 U$1.DF1 U$1.DJ1 U$1.DJ2 U$1.DK1 U$1.DM1 U$1.DN1 U$1.DP1 U$1.DR1 U$1.DS1 U$1.DU1 U$1.DU2 U$1.DV1 U$1.DV2 U$1.EB1 U$1.EB2 U$1.EL2 U$1.EM1 U$1.EM2 U$1.EN1 U$1.ER2 U$1.ES1 U$1.ES2 U$1.ET2 U$1.FA1 U$1.FB1 U$1.FB2 U$1.FC1 U$1.FD2 U$1.FE1 U$1.FE2 U$1.FF1 U$1.FF2 U$1.FH1 U$1.FH2 U$1.FJ2 U$1.FK1 U$1.FK2 U$1.FL1 U$1.FL2 U$1.FM2 U$1.FN1 U$1.FN2 U$1.FP1 U$1.FP2 U$1.FR1 U$1.FR2 U$1.FS1 U$1.FS2 U$1.FU1 U$1.FU2 U$1.FV1 U$1.FV2

### Notes on the sheet
- UNIBUS

## Sheet 5 of 7
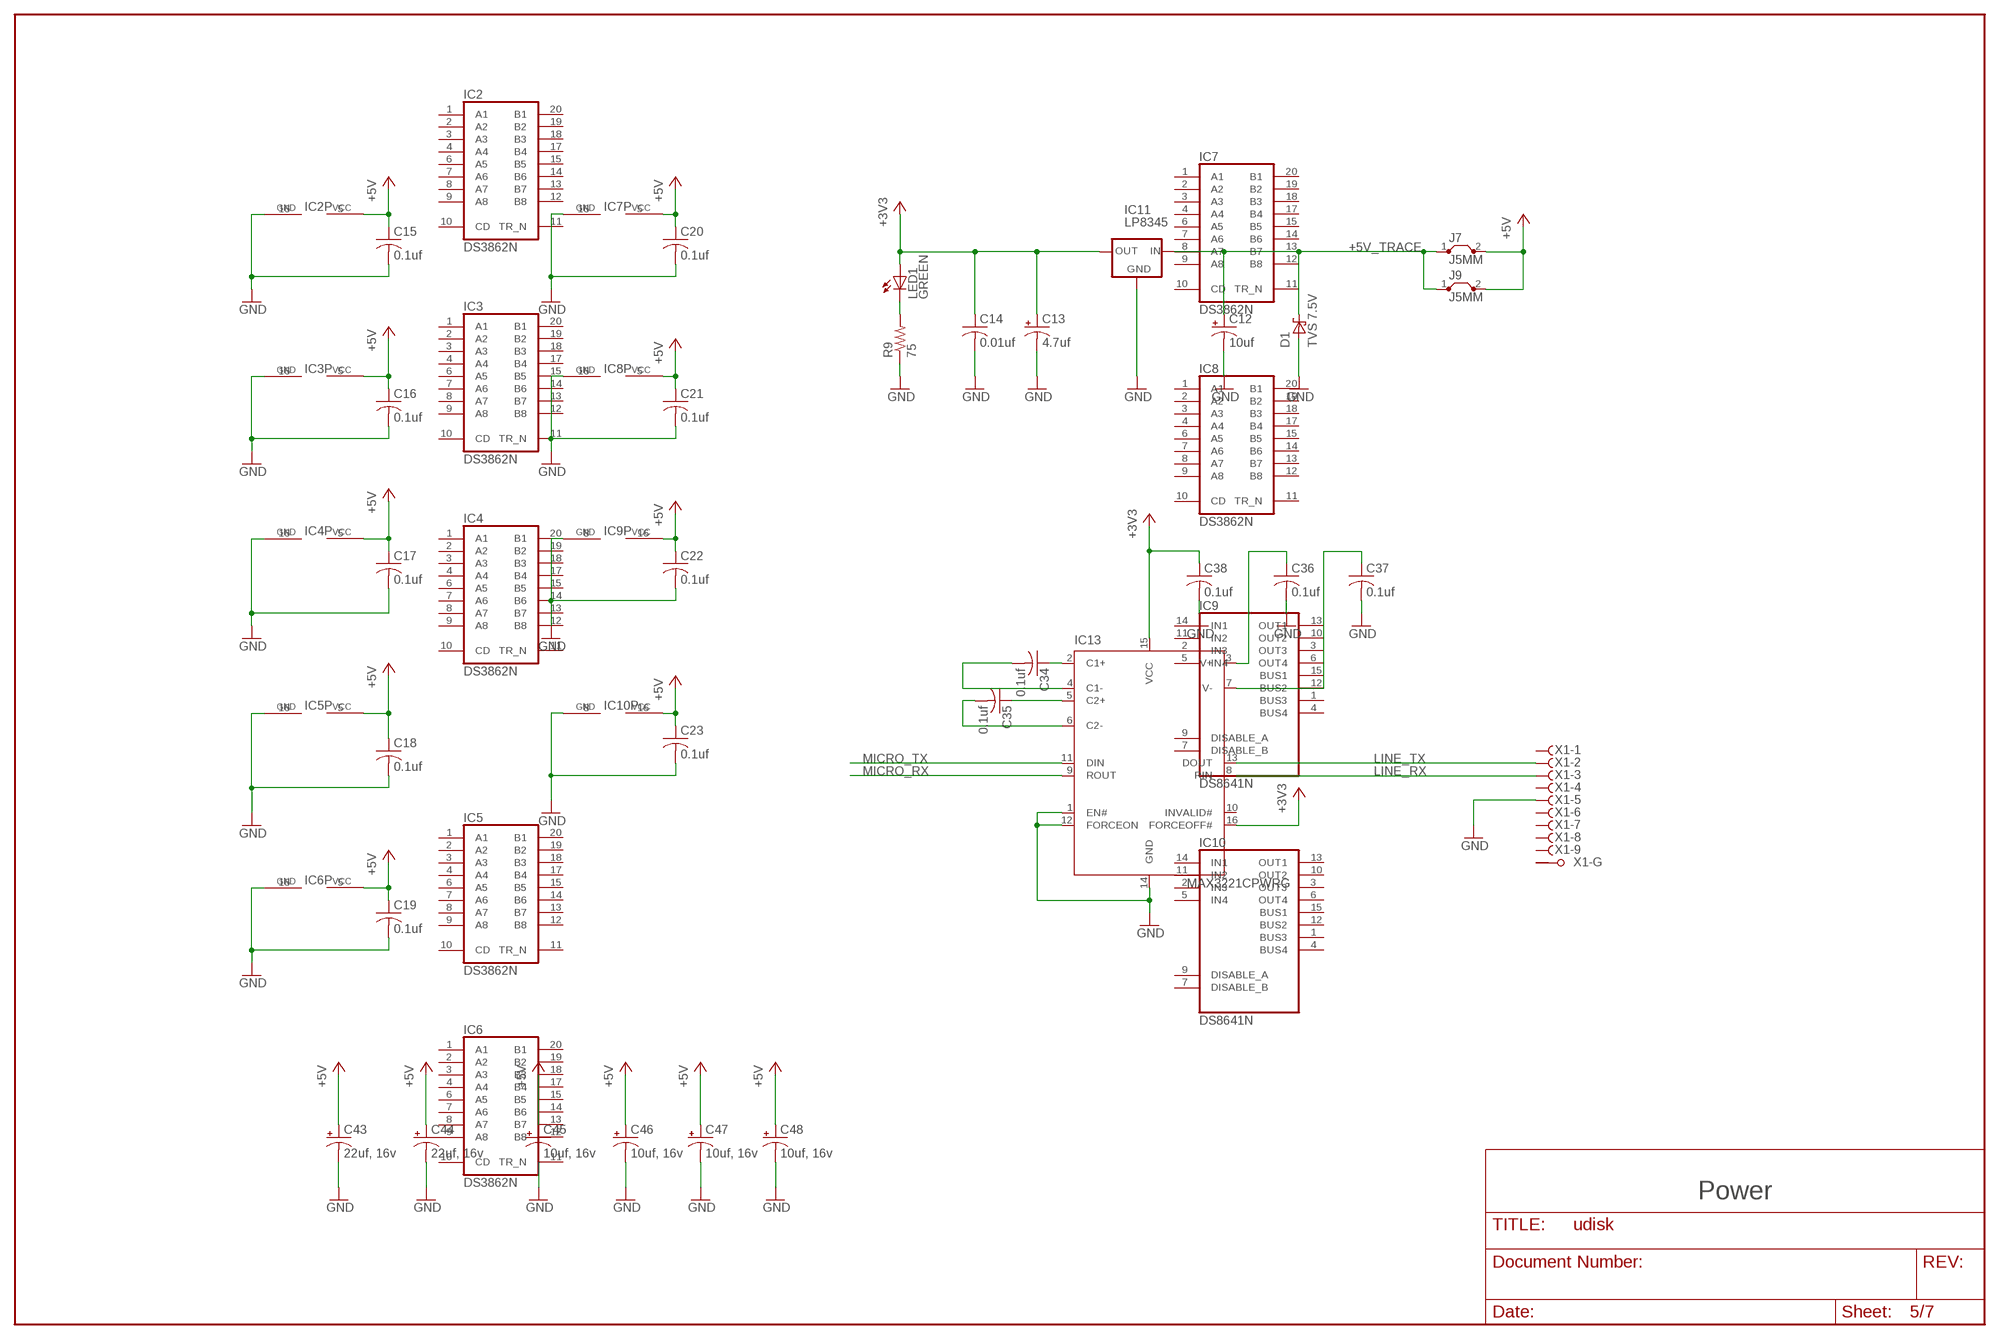
[diagram p4: schematic, sheet 5]

### Parts
C12  10uf  CPOL-USCT3216  [CT3216]
C13  4.7uf  CPOL-USCT3216  [CT3216]
C14  0.01uf  C-USC0805  [C0805]
C15  0.1uf  C-USC0603  [C0603]
C16  0.1uf  C-USC0603  [C0603]
C17  0.1uf  C-USC0603  [C0603]
C18  0.1uf  C-USC0603  [C0603]
C19  0.1uf  C-USC0603  [C0603]
C20  0.1uf  C-USC0603  [C0603]
C21  0.1uf  C-USC0603  [C0603]
C22  0.1uf  C-USC0603  [C0603]
C23  0.1uf  C-USC0603  [C0603]
C34  0.1uf  C-USC0603  [C0603]
C35  0.1uf  C-USC0603  [C0603]
C36  0.1uf  C-USC0603  [C0603]
C37  0.1uf  C-USC0603  [C0603]
C38  0.1uf  C-USC0603  [C0603]
C43  22uf, 16v  CPOL-USCT6032  [CT6032]
C44  22uf, 16v  CPOL-USCT6032  [CT6032]
C45  10uf, 16v  CPOL-USCT6032  [CT6032]
C46  10uf, 16v  CPOL-USCT6032  [CT6032]
C47  10uf, 16v  CPOL-USCT6032  [CT6032]
C48  10uf, 16v  CPOL-USCT6032  [CT6032]
D1  TVS 7.5V  1SMA16AT3  [SMA]
IC11  LP8345  [TO252]
IC13  MAX3221CPWRG  [TSSOP-16]
J7  J5MM  [05]
J9  J5MM  [05]
LED1  GREEN  LEDB156  [Q62902-B156]
R9  75  R-US_M0805  [M0805]
X1  F09HPS  [F09HP]

### Nets
+3V3: C13.+ C14.1 C38.1 IC11.1(OUT) IC13.15(VCC) IC13.16(FORCEOFF#) LED1.A ; also sheet 1,2,6,7
+5V: C15.1 C16.1 C17.1 C18.1 C19.1 C20.1 C21.1 C22.1 C23.1 C43.+ C44.+ C45.+ C46.+ C47.+ C48.+ IC2.5(VCC) IC3.5(VCC) IC4.5(VCC) IC5.5(VCC) IC6.5(VCC) IC7.5(VCC) IC8.5(VCC) IC9.16(VCC) IC10.16(VCC) J7.2 J9.2 ; also sheet 3,4,6
+5V_TRACE: C12.+ D1.1(K) IC11.2(IN) J7.1 J9.1
GND: C12.- C13.- C14.2 C15.2 C16.2 C17.2 C18.2 C19.2 C20.2 C21.2 C22.2 C23.2 C36.2 C37.2 C38.2 C43.- C44.- C45.- C46.- C47.- C48.- D1.2(A) IC2.16(GND) IC3.16(GND) IC4.16(GND) IC5.16(GND) IC6.16(GND) IC7.16(GND) IC8.16(GND) IC9.8(GND) IC10.8(GND) IC11.3(GND) IC13.1(EN#) IC13.12(FORCEON) IC13.14(GND) R9.1 X1.5(-5:F) ; also sheet 1,2,3,4,6,7
LINE_RX: IC13.8(RIN) X1.3(-3:F)
LINE_TX: IC13.13(DOUT) X1.2(-2:F)
MICRO_RX: IC13.9(ROUT) ; also sheet 1
MICRO_TX: IC13.11(DIN) ; also sheet 1
N$26: C35.1 IC13.5(C2+)
N$27: C34.1 IC13.2(C1+)
N$28: C34.2 IC13.4(C1-)
N$31: C35.2 IC13.6(C2-)
N$34: C36.1 IC13.3(V+)
N$35: C37.1 IC13.7(V-)
N$38: LED1.K(C) R9.2
Unconnected: IC4.3(A3) IC4.4(A4) IC4.6(A5) IC4.7(A6) IC4.8(A7) IC4.9(A8) IC4.12(B8) IC4.13(B7) IC4.14(B6) IC4.15(B5) IC4.17(B4) IC4.18(B3) IC7.6(A5) IC7.7(A6) IC7.8(A7) IC7.9(A8) IC7.12(B8) IC7.13(B7) IC7.14(B6) IC7.15(B5) IC8.9(A8) IC8.12(B8) IC13.10(INVALID#) X1.1(-1:F) X1.4(-4:F) X1.6(-6:F) X1.7(-7:F) X1.8(-8:F) X1.9(-9:F) X1.G1(-G:G1) X1.G2(-G:G2)

### Notes on the sheet
- Power

## Sheet 6 of 7
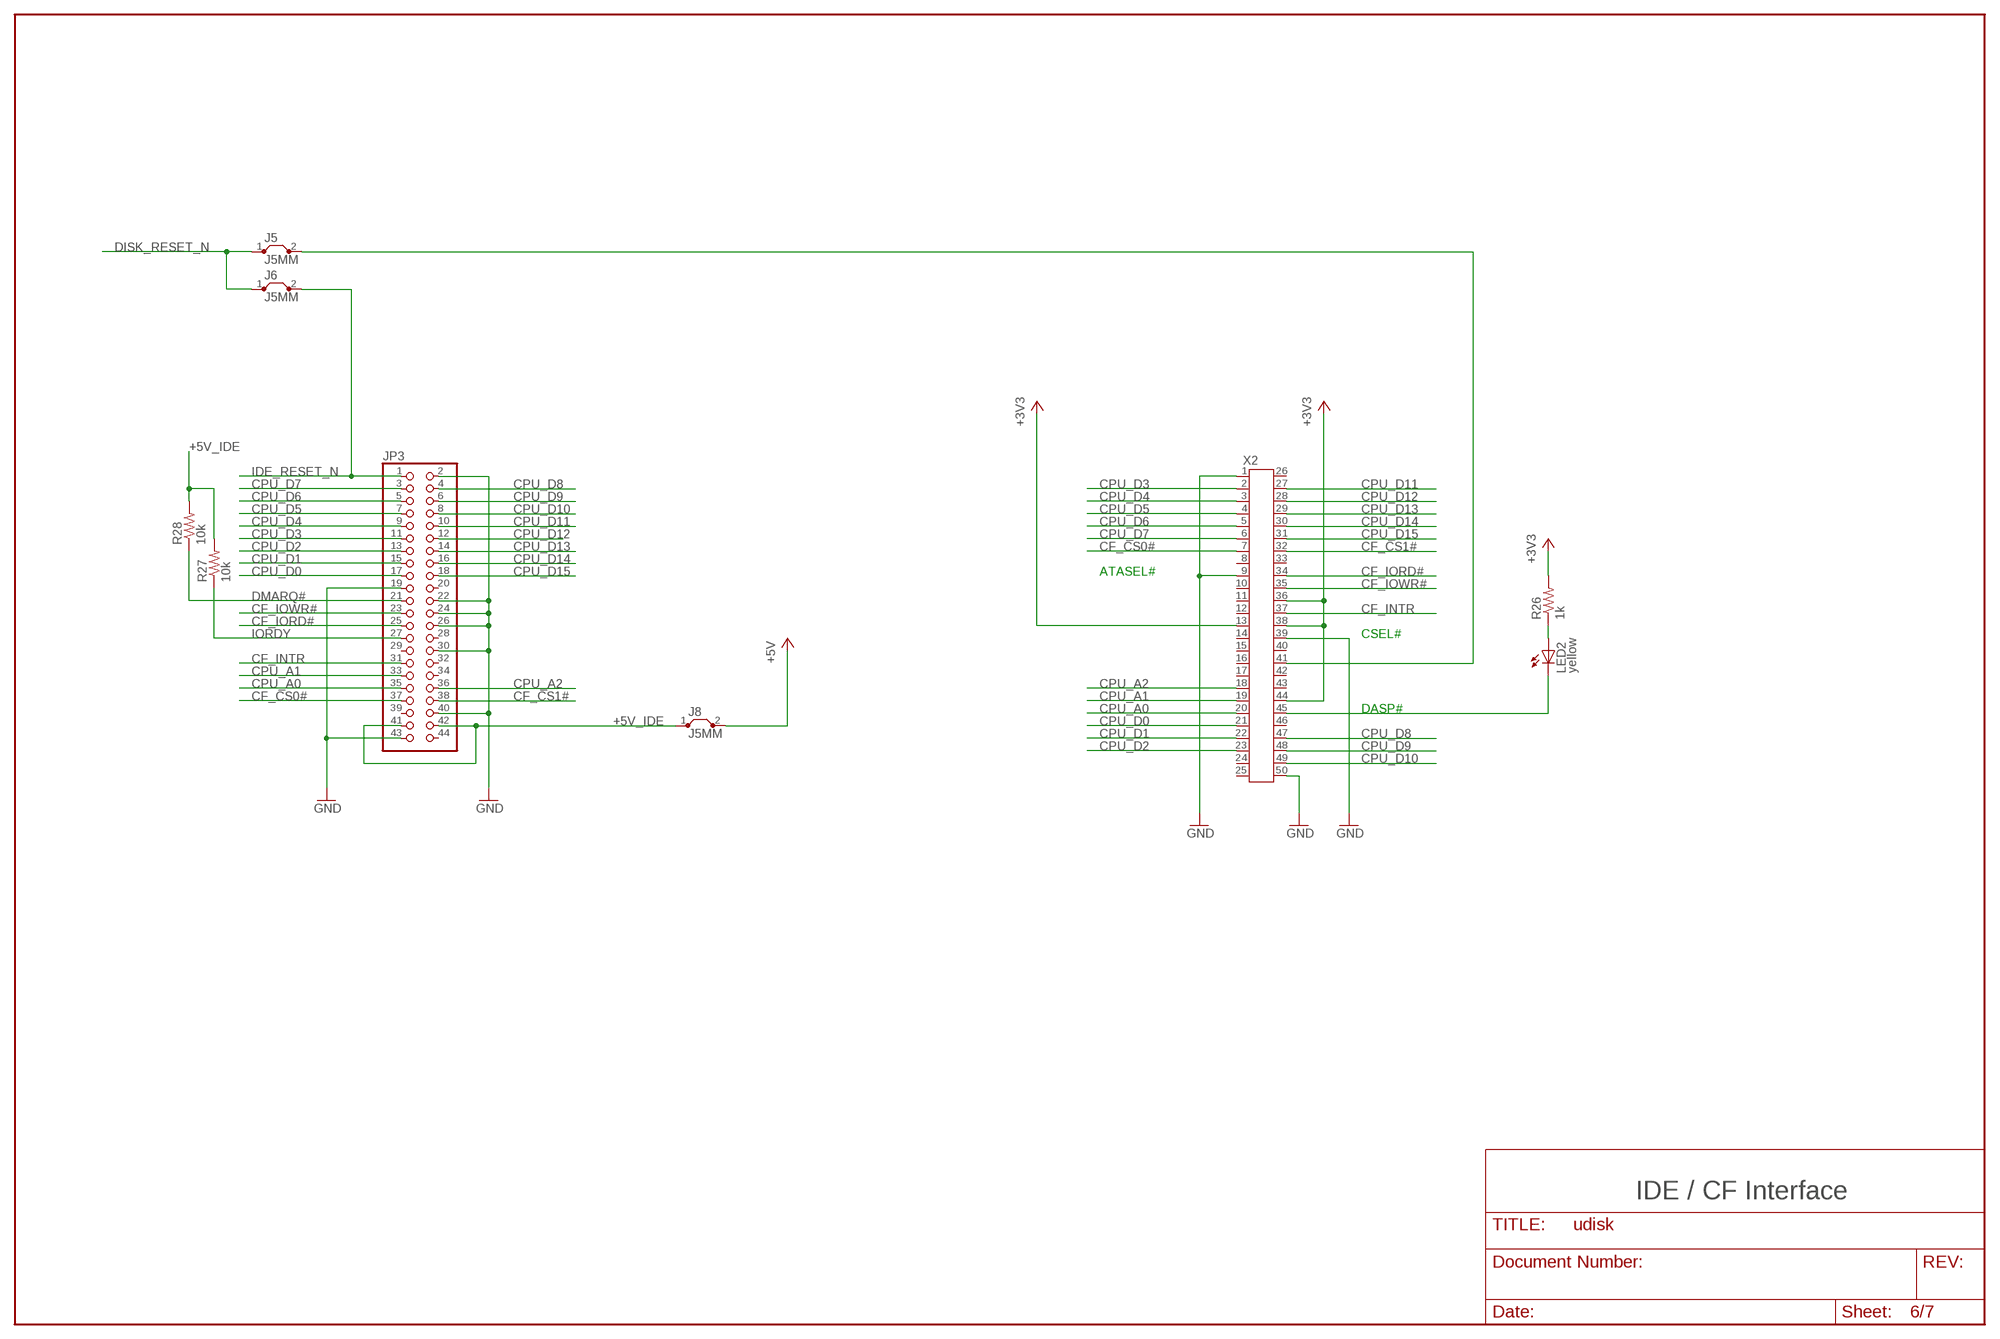
[diagram p5: schematic, sheet 6]

### Parts
J5  J5MM  [05]
J6  J5MM  [05]
J8  J5MM  [05]
JP3  PINHD-2X22  [2X22]
LED2  yellow  LEDB156  [Q62902-B156]
R26  1k  R-US_M0805  [M0805]
R27  10k  R-US_R0805  [R0805]
R28  10k  R-US_R0805  [R0805]
X2  N7E50516  [N7E50516]

### Nets
+3V3: R26.2 X2.13 X2.36 X2.38 X2.44 ; also sheet 1,2,5,7
+5V: J8.2 ; also sheet 3,4,5
+5V_IDE: J8.1 JP3.41 JP3.42 R27.2 R28.2
CF_CS0#: JP3.37 X2.7 ; also sheet 2
CF_CS1#: JP3.38 X2.32 ; also sheet 2
CF_INTR: JP3.31 X2.37
CF_IORD#: JP3.25 X2.34 ; also sheet 2
CF_IOWR#: JP3.23 X2.35 ; also sheet 2
CF_RESET_N: J5.2 X2.41
CPU_A0: JP3.35 X2.20 ; also sheet 1,2
CPU_A1: JP3.33 X2.19 ; also sheet 1,2
CPU_A2: JP3.36 X2.18 ; also sheet 1,2
CPU_D0: JP3.17 X2.21 ; also sheet 1,2
CPU_D1: JP3.15 X2.22 ; also sheet 1,2
CPU_D2: JP3.13 X2.23 ; also sheet 1,2
CPU_D3: JP3.11 X2.2 ; also sheet 1,2
CPU_D4: JP3.9 X2.3 ; also sheet 1,2
CPU_D5: JP3.7 X2.4 ; also sheet 1,2
CPU_D6: JP3.5 X2.5 ; also sheet 1,2
CPU_D7: JP3.3 X2.6 ; also sheet 1,2
CPU_D8: JP3.4 X2.47 ; also sheet 1,2
CPU_D9: JP3.6 X2.48 ; also sheet 1,2
CPU_D10: JP3.8 X2.49 ; also sheet 1,2
CPU_D11: JP3.10 X2.27 ; also sheet 1,2
CPU_D12: JP3.12 X2.28 ; also sheet 1,2
CPU_D13: JP3.14 X2.29 ; also sheet 1,2
CPU_D14: JP3.16 X2.30 ; also sheet 1,2
CPU_D15: JP3.18 X2.31 ; also sheet 1,2
DISK_RESET_N: J5.1 J6.1 ; also sheet 2
DMARQ#: JP3.21 R28.1
GND: JP3.2 JP3.19 JP3.22 JP3.24 JP3.26 JP3.30 JP3.40 JP3.43 X2.1 X2.9 X2.39 X2.50 ; also sheet 1,2,3,4,5,7
IDE_RESET_N: J6.2 JP3.1
IORDY: JP3.27 R27.1
N$17: LED2.A R26.1
N$70: LED2.K(C) X2.45
Unconnected: JP3.20 JP3.28 JP3.29 JP3.32 JP3.34 JP3.39 JP3.44 X2.8 X2.10 X2.11 X2.12 X2.14 X2.15 X2.16 X2.17 X2.24 X2.25 X2.26 X2.33 X2.40 X2.42 X2.43 X2.46

### Notes on the sheet
- ATASEL#
- CSEL#
- DASP#
- IDE / CF Interface

## Sheet 7 of 7
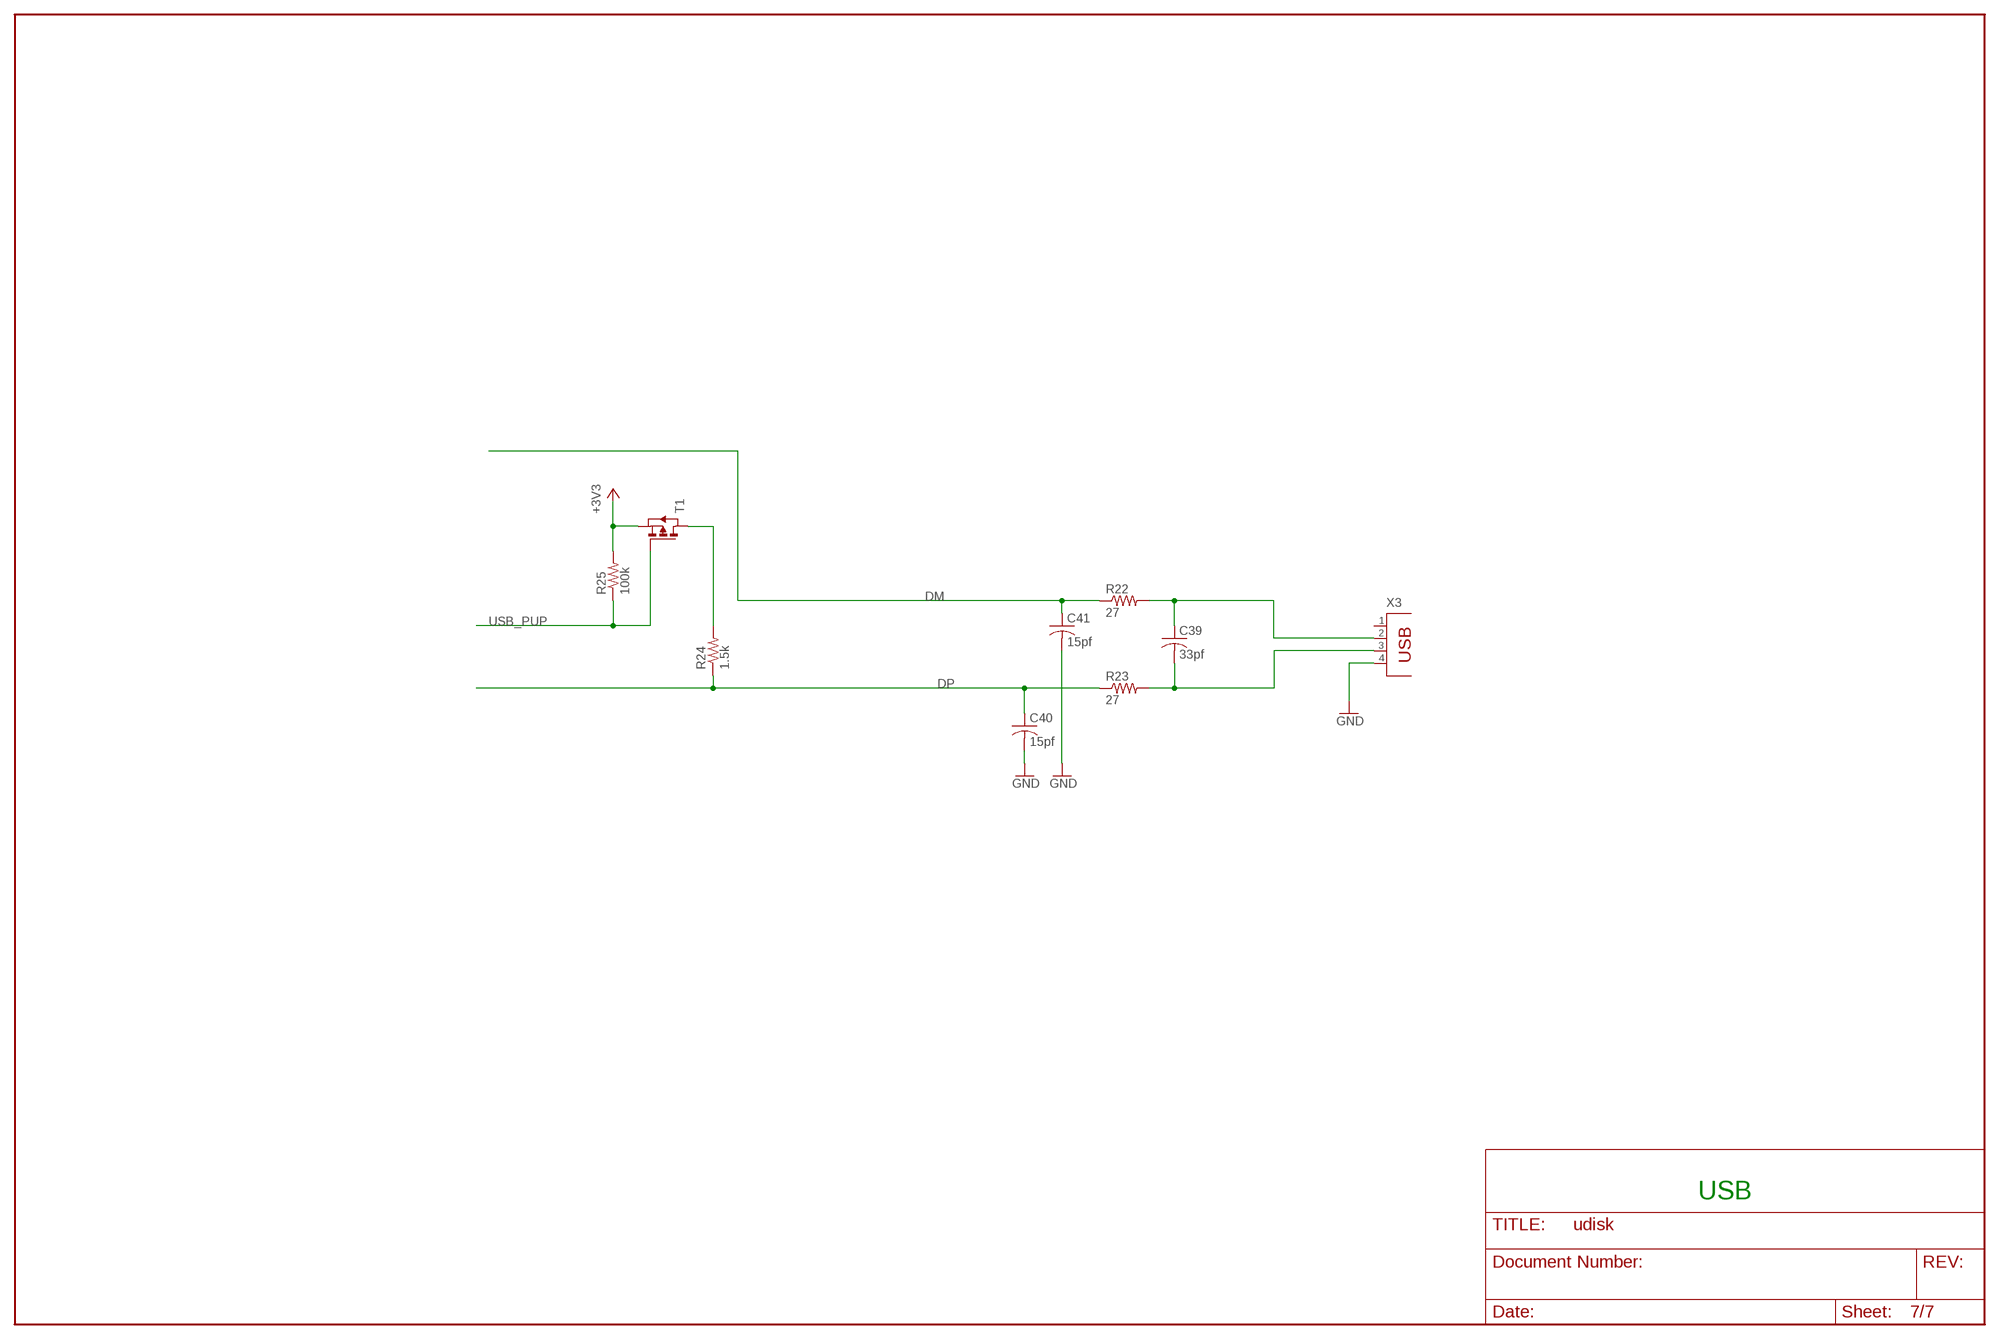
[diagram p6: schematic, sheet 7]

### Parts
C39  33pf  C-USC0805  [C0805]
C40  15pf  C-USC0805  [C0805]
C41  15pf  C-USC0805  [C0805]
R22  27  R-US_R0805  [R0805]
R23  27  R-US_R0805  [R0805]
R24  1.5k  R-US_R0805  [R0805]
R25  100k  R-US_R0805  [R0805]
T1  PMOSSOT23  [SOT-23]
X3  PN61729  [PN61729]

### Nets
+3V3: R25.2 T1.2(S) ; also sheet 1,2,5,6
DM: C41.1 R22.1 ; also sheet 1
DP: C40.1 R23.1 R24.1 ; also sheet 1
GND: C40.2 C41.2 X3.4 ; also sheet 1,2,3,4,5,6
N$51: C39.1 R22.2 X3.2
N$52: R24.2 T1.1(D)
N$53: C39.2 R23.2 X3.3
USB_PUP: R25.1 T1.3(G) ; also sheet 1
Unconnected: X3.1

### Notes on the sheet
- USB

## Library data of the parts
C1-C11 C14-C41 = rcl:C-US: CAPACITOR, American symbol
C12 C13 C43-C48 = rcl:CPOL-US: POLARIZED CAPACITOR, American symbol
D1 = 1SMA16AT3:1SMA16AT3: ZENER DIODE
IC1 = xcr3256xl:XCR3256XLTQ144
IC2-IC8 = unibus-dip:DS3862: Octal High Speed Trapezoidal Bus TransceiverBUS TRANSCEIVER
IC9 IC10 = unibus-dip:DS8641: Quad Unified Bus TransceiverBUS TRANSCEIVER
IC11 = lp8345:LP8345: VOLTAGE REGULATOR
IC12 = atmel_prototype_header:AT91SAM7S64: Atmel AT91 ARM Thumb-based Microcontroller. LQFP64 package.
IC13 = ti-max3221:MAX3221CPWR: RS-232 Line driver/receiver
J1-J9 = jumper:J: Bridge
JP1 = pinhead:PINHD-1X6: PIN HEADER
JP2 = pinhead:PINHD-2X10: PIN HEADER
JP3 = 2mm_2x22:PINHD-2X22: PIN HEADER
LED1-LED3 = led:LED: LED OSRAM: - CHIPLED LG R971, LG N971, LY N971, LG Q971, LY Q971, LO R971, LY R971 LH N974, LH R974 LS Q976, LO Q976, LY Q976 LO Q996 - Hyper CHIPLED LW Q18S LB Q993, LB Q99A, LB R99A - SideLED LS A670, LO A670, LY A670, LG A670, LP A670 LB A673, LV A673, LT A673, LW A673 LH A674 LY A675 LS A676, LA A676, LO A676, LY A676, LW A676 LS A679, LY A679, LG A679 - Hyper Micro SIDELED® LS Y876, LA Y876, LO Y876, LY Y876 LT Y87S - SmartLED LW L88C, LW L88S LB L89C, LB L89S, LG L890 LS L89K, LO L89K, LY L89K LS L896, LA L896, LO L896, LY L896 - TOPLED LS T670, LO T670, LY T670, LG T670, LP T670 LSG T670, LSP T670, LSY T670, LOP T670, LYG T670 LG T671, LOG T671, LSG T671 LB T673, LV T673, LT T673, LW T673 LH T674 LS T676, LA T676, LO T676, LY T676, LB T676, LH T676, LSB T676, LW T676 LB T67C, LV T67C, LT T67C, LS T67K, LO T67K, LY T67K, LW E67C LS E67B, LA E67B, LO E67B, LY E67B, LB E67C, LV E67C, LT E67C LW T67C LS T679, LY T679, LG T679 LS T770, LO T770, LY T770, LG T770, LP T770 LB T773, LV T773, LT T773, LW T773 LH T774 LS E675, LA E675, LY E675, LS T675 LS T776, LA T776, LO T776, LY T776, LB T776 LHGB T686 LT T68C, LB T68C - Hyper Mini TOPLED® LB M676 - Mini TOPLED Santana® LG M470 LS M47K, LO M47K, LY M47K Source: http://www.osram.convergy.de/
Q1 = cts406:CTS406: CTS 406 CRYSTAL
R1-R42 = rcl:R-US_: RESISTOR, American symbol
S1 = itt-ksc241j:KSC241J: PUSH SWITCH ITT-Cannon
T1 = zetex:PMOSSOT23: MOS FET
U$1 = unibus-cdef:QUAD-CDEF: Quad-Height CDEF DEC Edge Connector
X1 = con-subd:F09HPS: SUB-D
X2 = 3M:N7E50516: 3M N7E50-7516-HG-40 Compact Flash Socket
X3 = con-berg:PN61729: BERG